# EAGLE design G11_CG_for_G8 (EAGLE 9.2.2)
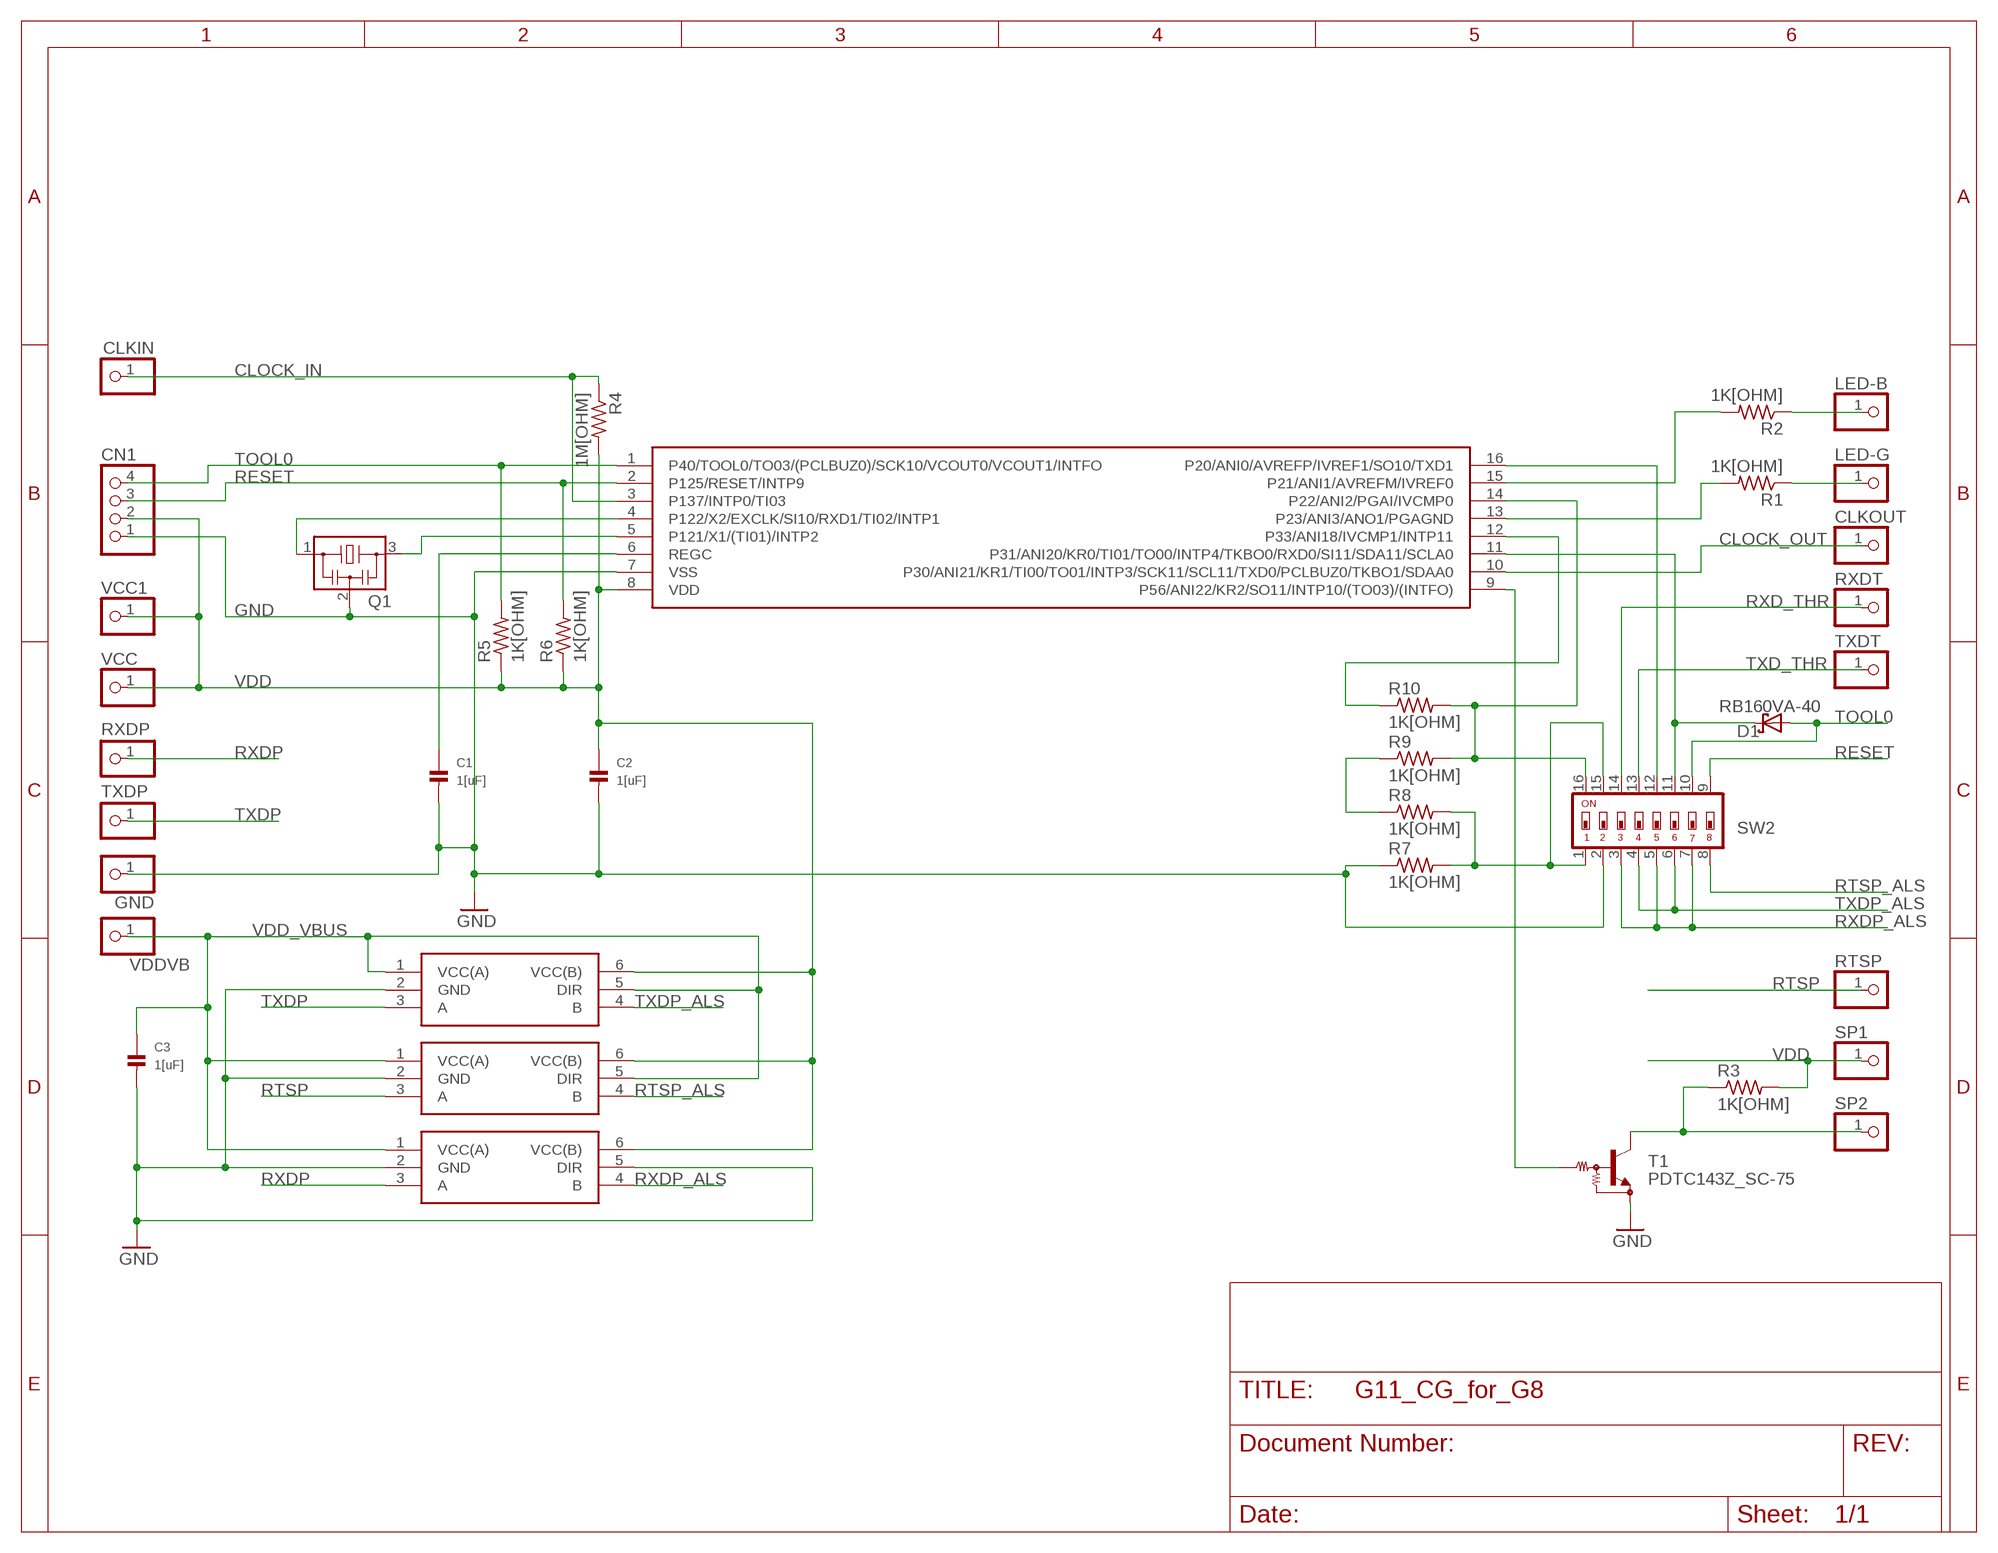
[diagram p0: schematic, sheet 1]

## Parts
C1  1[uF]  CAP_CERAMIC_0603  [_0603]
C2  1[uF]  CAP_CERAMIC_0603  [_0603]
C3  1[uF]  CAP_CERAMIC_0603  [_0603]
CLKIN  PINHD-1X1  [1X01]
CLKOUT  PINHD-1X1  [1X01]
CN1  PINHD-1X4  [1X04]
D1  RB160VA-40  [TUMD2]
GND  PINHD-1X1  [1X01]
LED-B  PINHD-1X1  [1X01]
LED-G  PINHD-1X1  [1X01]
Q1  CSTNE  [CSTNE]
R1  1K[OHM]  R-US_R0603  [R0603]
R2  1K[OHM]  R-US_R0603  [R0603]
R3  1K[OHM]  R-US_R0603  [R0603]
R4  1M[OHM]  R-US_R0603  [R0603]
R5  1K[OHM]  R-US_R0603  [R0603]
R6  1K[OHM]  R-US_R0603  [R0603]
R7  1K[OHM]  R-US_R0603  [R0603]
R8  1K[OHM]  R-US_R0603  [R0603]
R9  1K[OHM]  R-US_R0603  [R0603]
R10  1K[OHM]  R-US_R0603  [R0603]
RTSP  PINHD-1X1  [1X01]
RXDP  PINHD-1X1  [1X01]
RXDT  PINHD-1X1  [1X01]
SP1  PINHD-1X1  [1X01]
SP2  PINHD-1X1  [1X01]
SW2  SWS008  [SMS-008]
T1  PDTC143Z_SC-75  DTC1XXXZPDTC143Z  [SC-75]
TXDP  PINHD-1X1  [1X01]
TXDT  PINHD-1X1  [1X01]
U1  RL78/G11_SSOP16  [SSOP16_(4.4X5.0)]
U2  74LVC1T45W6  [SOT-26]
U3  74LVC1T45W6  [SOT-26]
U4  74LVC1T45W6  [SOT-26]
VCC  PINHD-1X1  [1X01]
VCC1  PINHD-1X1  [1X01]
VDDVB  PINHD-1X1  [1X01]

## Nets
CLOCK_IN: CLKIN.1 R4.1 U1.3(P137/INTP0/TI03)
CLOCK_OUT: CLKOUT.1 U1.10(P30/ANI21/KR1/TI00/TO01/INTP3/SCK11/SCL11/TXD0/PCLBUZ0/TKBO1/SDAA0)
GND: C1.2 C2.2 C3.2 CN1.1 GND.1 Q1.2 R7.1 SW2.2 T1.2(E) U1.7(VSS) U2.2(GND) U3.2(GND) U4.2(GND) U4.5(DIR)
N$2: R3.1 SP2.1 T1.3(C)
N$3: T1.1(B) U1.9(P56/ANI22/KR2/SO11/INTP10/(TO03)/(INTFO))
N$4: LED-B.1 R2.1
N$6: LED-G.1 R1.1
N$7: R1.2 U1.13(P23/ANI3/ANO1/PGAGND)
N$8: Q1.3 U1.5(P121/X1/(TI01)/INTP2)
N$9: R2.2 U1.15(P21/ANI1/AVREFM/IVREF0)
N$10: Q1.1 U1.4(P122/X2/EXCLK/SI10/RXD1/TI02/INTP1)
N$11: C1.1 U1.6(REGC)
N$13: R9.2 R10.2 SW2.16 U1.14(P22/ANI2/PGAI/IVCMP0)
N$14: SW2.12 U1.16(P20/ANI0/AVREFP/IVREF1/SO10/TXD1)
N$15: R8.1 R9.1
N$16: R7.2 R8.2 SW2.1 SW2.15
N$17: R10.1 U1.12(P33/ANI18/IVCMP1/INTP11)
N$19: D1.P$1(C) SW2.11 U1.11(P31/ANI20/KR0/TI01/TO00/INTP4/TKBO0/RXD0/SI11/SDA11/SCLA0)
RESET: CN1.3 R6.2 SW2.9 U1.2(P125/RESET/INTP9)
RTSP: RTSP.1 U3.3(A)
RTSP_ALS: SW2.8 U3.4(B)
RXD_THR: RXDT.1 SW2.14
RXDP: RXDP.1 U4.3(A)
RXDP_ALS: SW2.3 SW2.5 SW2.7 U4.4(B)
TOOL0: CN1.4 D1.P$2(A) R5.2 SW2.10 U1.1(P40/TOOL0/TO03/(PCLBUZ0)/SCK10/VCOUT0/VCOUT1/INTFO)
TXD_THR: SW2.13 TXDT.1
TXDP: TXDP.1 U2.3(A)
TXDP_ALS: SW2.4 SW2.6 U2.4(B)
VDD: C2.1 CN1.2 R3.2 R4.2 R5.1 R6.1 SP1.1 U1.8(VDD) U2.6(VCC(B)) U3.6(VCC(B)) U4.6(VCC(B)) VCC1.1 VCC.1
VDD_VBUS: C3.1 U2.1(VCC(A)) U2.5(DIR) U3.1(VCC(A)) U3.5(DIR) U4.1(VCC(A)) VDDVB.1

## Library data of the parts
C1-C3 = microbuilder:CAP_CERAMIC: Ceramic Capacitors 0402 - 0402 Surface Mount Capacitors 16pF 50V 5% [Digikey: 445-4899-2-ND] 18pF 50V 5% [Digikey: 490-1281-2-ND] 22pF 50V 5% [Digikey: 490-1283-2-ND] 68pF 50V 5% [Digikey: 490-1289-2-ND] 0.1uF 10V 10% [Digikey: 490-1318-2-ND] 1.0uF 6.3V 10% [Digikey: 490-1320-2-ND] 0603 - 0603 Surface Mount Capacitors 16 pF 50V 5% [Digikey: 445-5051-2-ND] 22 pF 50V [Digikey: PCC220ACVTR-ND] 33 pF 50V 5% [Digikey: 490-1415-1-ND] 56pF 50V 5% [Digikey: 490-1421-1-ND] 220pF 50V 5% [Digikey: 445-1285-1-ND] 680 pF 50V 2200 pF 50V 5% C0G [Digikey: 445-1297-1-ND] 5600 pF 100V 5% X7R [Digikey: 478-3711-1-ND] 0.1 µF 25V 10% [Digikey: PCC2277TR-ND] 0.22 µF 16V 10% X7R [Digikey: 445-1318-1-ND] 1.0 µF 25V 10% [Digikey: 445-5146-2-ND] 0603 - RF Specific 3pF 250V +/-0.1pF RF [Digikey: 712-1347-1-ND] 18 pF 250V 5% [Digikey: 478-3505-1-ND or 712-1322-1-ND] 56 pF 250V 5% C0G RF [Digikey: 490-4867-1-ND] 68 pF 250V RF [Digikey: 490-4868-1-ND] 0805 - 0805 Surface Mount Capacitors 220 pF 250V 2% RF Ceramic Capacitor [Digikey: 712-1398-1-ND] 1000 pF 50V 2% NP0 Ceramic Capacitor [Digikey: 478-3760-1-ND] 0.1 µF 25V 10% Ceramic Capacitor [Digikey: PCC1828TR-ND] 1.0 µF 16V 10% Ceramic Capacitor[Digikey: 490-1691-2-ND] 10.0 µF 10V 10% Ceramic Capacitor[Digikey: 709-1228-1-ND] 10.0 uF 16V 10% Ceramic Capacitor [Digikey: 478-5165-2-ND] 47 uF 6.3V 20% Ceramic Capacitor [Digikey: 587-1779-1-ND or 399-5506-1-ND] 1206 - 1206 Surface Mount Capacitors 47uF 10V 20% Ceramic Capacitor [Digikey: 490-5528-1-ND or 399-5508-1-ND or 445-6010-1-ND] 100uF 6.3V -20%, +80% Y5V Ceramic Capacitor (Digikey: 490-4512-1-ND, Mouser: 81-GRM31CF50J107ZE1L)
CLKIN CLKOUT GND LED-B LED-G RTSP RXDP RXDT SP1 SP2 TXDP TXDT VCC VCC1 VDDVB = pinhead:PINHD-1X1: PIN HEADER
CN1 = pinhead:PINHD-1X4: PIN HEADER
D1 = okadaLib:RB160VA-40: ROHM shottkey diode
Q1 = yoshino_low_tech:CSTNE: Murata Ceramic Resonator CSTNE Series
R1-R10 = resistor:R-US_: RESISTOR, American symbol
SW2 = smd-special:SWS008: SMD Dip Switch 8 pol.
T1 = okadaLib:DTC1XXXZ: Digital Transistor
U1 = yoshino_low_tech:RL78/G11_SSOP16: 16bit MCU RL78/G11 16pin SSOP
U2-U4 = yoshino_low_tech:74LVC1T45W6: Bidirectional 1circuit Level shifter https://www.diodes.com/assets/Datasheets/74LVC1T45.pdf

## Net classes
2 GND: width 0.254 mm

## Board
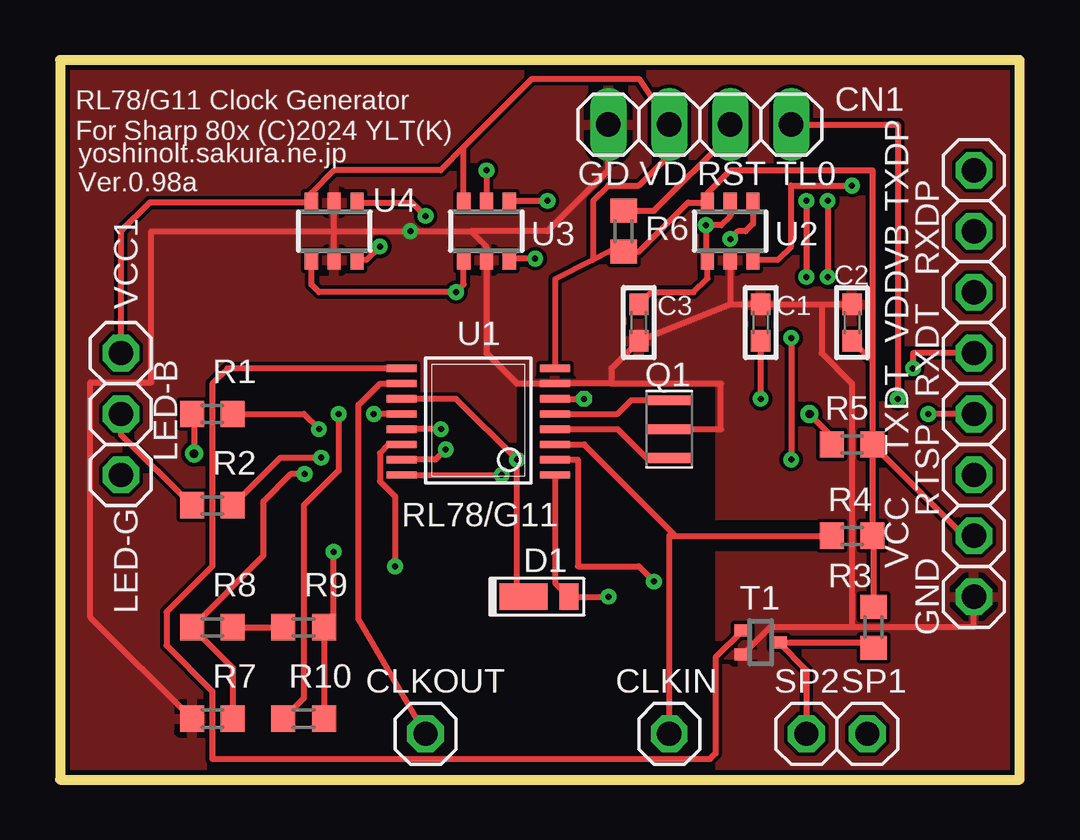
[diagram p1: board, top side]
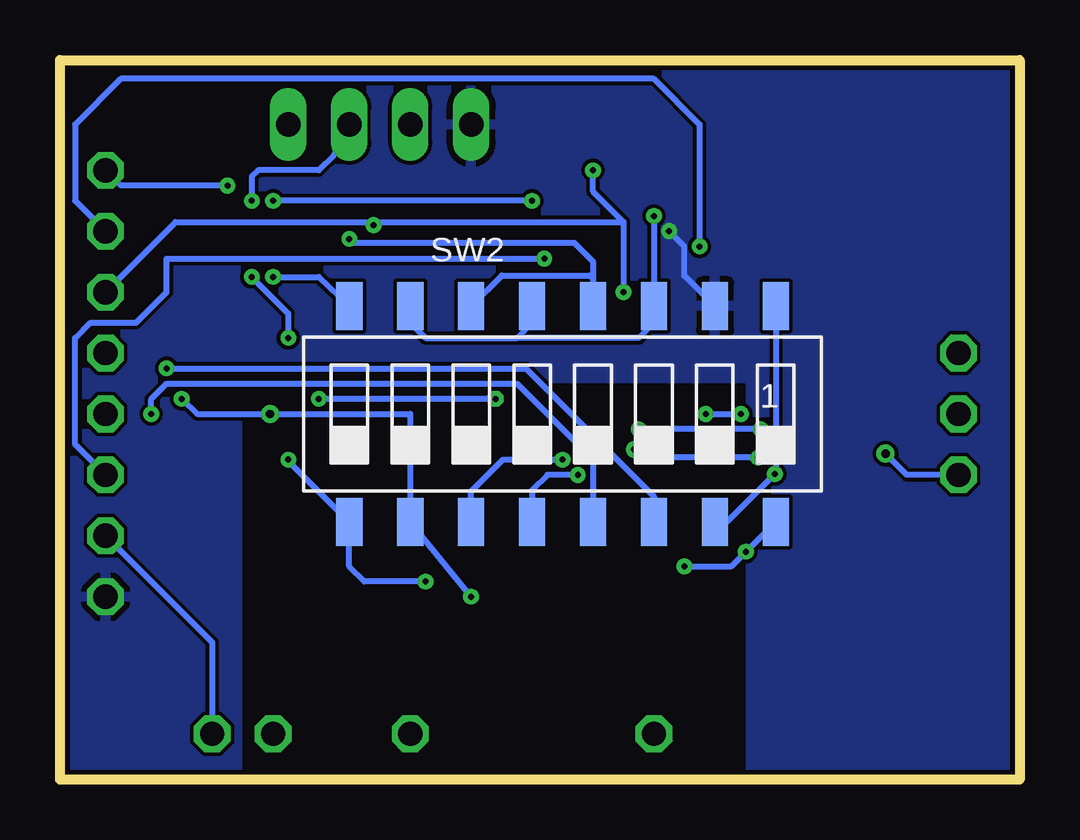
[diagram p2: board, bottom side, seen from below]

Size 40 x 30 mm. Coordinates in mm from the lower left corner, seen from the top.
Outline: 0,0 40,0 40,30 0,30 0,0
Copper layers (1*16): Top 0.035mm / dielectric 1.5mm / Bottom 0.035mm
Design rules "PCBGoGo": minimum track width 6mil, minimum drill 0.2mm, track to track 6mil, track to pad 6mil, pad to pad 6mil, via to via 6mil, smd to smd 6mil, copper to edge 0.2mm, drill to drill 6mil, minimum pad ring 10mil, minimum via ring 8mil, stop-mask expansion 4mil, vias tented up to drill 0mil, thermal gap 10mil
tRestrict: area 19.1,0 to 27.3,16.5; area 27.3,9.5 to 31.5,10.8
bRestrict: area 11.4,0 to 32.4,16.5

### Footprints (pad centres in the part's own frame; a part is rotated, then mirrored left to right if it is on the bottom)
_0603 = smd 0.9 x 0.8: 1 -0.762,0; 2 0.762,0
1X01 = drill 1.016 octagon: 1 0,0
1X04 = drill 1.016 long: 1 -3.81,0; 2 -1.27,0; 3 1.27,0; 4 3.81,0
TUMD2 = smd 1.1 x 2: P$1 0,1 | smd 1.1 x 0.8: P$2 0,-0.9
CSTNE = smd 0.4 x 1.9: 1 -1.2,0; 2 0,0; 3 1.2,0
R0603 = smd 1 x 1.1: 1 -0.85,0; 2 0.85,0
SMS-008 = smd 1.092 x 2.007: 1 -8.89,-4.496; 2 -6.35,-4.496; 3 -3.81,-4.496; 4 -1.27,-4.496; 5 1.27,-4.496; 6 3.81,-4.496; 7 6.35,-4.496; 8 8.89,-4.496; 9 8.89,4.496; 10 6.35,4.496; 11 3.81,4.496; 12 1.27,4.496; 13 -1.27,4.496; 14 -3.81,4.496; 15 -6.35,4.496; 16 -8.89,4.496
SC-75 = smd 0.5 x 0.7: 1 -0.5,-0.75; 2 0.5,-0.75; 3 0,0.75
SSOP16_(4.4X5.0) = smd 0.305 x 1.245: 1 0,-5.4; 2 0.635,-5.4; 3 1.27,-5.4; 4 1.905,-5.4; 5 2.54,-5.4; 6 3.175,-5.4; 7 3.81,-5.4; 8 4.445,-5.4; 9 4.445,1; 10 3.81,1; 11 3.175,1; 12 2.54,1; 13 1.905,1; 14 1.27,1; 15 0.635,1; 16 0,1
SOT-26 = smd 0.55 x 0.8: 1 -0.95,-1.2; 2 0,-1.2; 3 0.95,-1.2; 4 0.95,1.2; 5 0,1.2; 6 -0.95,1.2

### Placement (x,y rotation side)
C1  29.21,19.05 90 top
C2  33.02,19.05 90 top
C3  24.13,19.05 270 top
CLKIN  25.4,1.91 90 top
CLKOUT  15.24,1.91 90 top
CN1  26.67,27.3 0 top
D1  20.32,7.62 90 top
GND  38.1,7.62 0 top
LED-B  2.54,15.24 90 top
LED-G  2.54,12.7 90 top
Q1  25.4,14.61 90 top
R1  6.35,15.24 0 top
R2  6.35,11.43 0 top
R3  33.91,6.35 90 top
R4  33.02,10.16 0 top
R5  33.02,13.97 180 top
R6  23.5,22.86 90 top
R7  6.35,2.54 0 top
R8  6.35,6.35 180 top
R9  10.16,6.35 0 top
R10  10.16,2.54 0 top
RTSP  38.1,12.7 90 top
RXDP  38.1,22.86 90 top
RXDT  38.1,17.78 90 top
SP1  33.66,1.91 0 top
SP2  31.11,1.91 0 top
SW2  19.05,15.24 180 bottom
T1  29.21,5.71 270 top
TXDP  38.1,25.4 90 top
TXDT  38.1,15.24 90 top
U1  15.24,12.7 90 top
U2  27.94,22.86 0 top
U3  17.78,22.86 0 top
U4  11.43,22.86 0 top
VCC  38.1,10.16 0 top
VCC1  2.54,17.78 270 top
VDDVB  38.1,20.32 90 top

### Tracks (layer width: path | path; a pad name or v marks a point on that pad's centre or on a via)
CLOCK_IN
  Top 0.254: CLKIN.1 25.4,10.16 25.65,10.16 | 25.65,10.16 R4.1 | U1.3 21.84,13.97 25.65,10.16
CLOCK_OUT
  Top 0.254: CLKOUT.1 12.45,6.7 12.45,15.62 13.34,16.51 U1.10
GND  (via drill 0.25)
  Top 0.254: 27.94,19.81 C1.2 C2.2 31.75,19.81 31.75,17.78 33.02,16.51 33.02,14.61 33.02,6.35 | 27.94,19.81 C3.2 22.99,17.14 22.99,16.51 | U2.2 27.94,19.81 | 22.99,16.51 U1.7 19.05,16.51 17.78,17.78 U3.2 17.78,22.23 17.14,22.86 | U4.2 11.43,22.86 | 11.43,22.86 U4.5 | 11.43,22.86 v14.61,22.86 17.14,22.86 | 33.02,6.35 29.59,6.35 T1.2 | GND.1 38.1,6.35 33.02,6.35 | 17.14,22.86 20.32,22.86 22.86,25.4 CN1.1 | R7.1 1.27,6.77 1.27,16.56 3.81,16.56 3.81,22.86 11.43,22.86 | 22.99,16.51 27.56,16.51 27.56,14.61 Q1.2
  Bottom 0.254: SW2.2 13.97,21.01 13.97,22.23 v14.61,22.86
  pour Top: 40,30 0,30 0,0 40,0
  pour Bottom: 40,30 0,30 0,0 40,0
N$2
  Top 0.254: R3.1 33.69,5.71 T1.3 31.11,4.56 SP2.1
N$3
  Top 0.254: U1.9 6.99,17.14 6.35,16.51 6.35,8.89 4.45,6.99 4.45,5.59 6.35,3.68 6.35,0.86 27.1,0.86 27.33,1.09 27.33,5.08 T1.1
N$4
  Top 0.254: R2.1 2.54,14.39 LED-B.1
N$6  (via drill 0.35)
  Top 0.254: R1.1 5.59,15.15 v5.59,13.59
  Bottom 0.254: v5.59,13.59 4.7,12.7 LED-G.1
N$7  (via drill 0.25)
  Top 0.254: R1.2 10.16,15.24 v10.79,14.61 | v15.88,14.61 U1.13
  Bottom 0.254: v10.79,14.61 v15.88,14.61
N$8
  Top 0.254: U1.5 23.24,15.24 23.81,15.8 Q1.3
N$9  (via drill 0.25)
  Top 0.254: R2.2 9.19,13.42 v10.88,13.42 | v16.08,13.76 15.65,13.34 U1.15
  Bottom 0.254: v10.88,13.42 15.74,13.42 v16.08,13.76
N$10
  Top 0.254: U1.4 23.25,14.61 24.45,13.4 Q1.1
N$11  (via drill 0.25)
  Top 0.254: U1.6 v21.84,15.88 | v29.21,15.88 C1.1
  Bottom 0.254: v21.84,15.88 v29.21,15.88
N$13  (via drill 0.25)
  Top 0.254: R10.2 R9.2 11.4,6.75 v11.4,9.5 | U1.14 | U1.14 13.71,13.97 13.34,13.6 13.34,12.43 13.97,11.8 v13.97,8.89
  Bottom 0.254: v13.97,8.89 12.01,8.89 v11.4,9.5 SW2.16
N$14  (via drill 0.25)
  Top 0.254: U1.16 v18.41,12.7
  Bottom 0.254: v18.41,12.7 19.68,12.7 20.32,12.06 SW2.12
N$15
  Top 0.254: R8.1 R9.1
N$16  (via drill 0.25)
  Top 0.254: R7.2 7.2,4.65 R8.2 8.48,9.33 8.48,11.6 9.62,12.74 v10.2,12.74
  Bottom 0.254: SW2.1 10.16,12.78 v10.2,12.74 12.19,10.74 SW2.15
N$17  (via drill 0.25)
  Top 0.254: U1.12 v13.08,15.24 | v11.62,15.24 11.62,12.88 10.16,11.43 10.16,3.39 R10.1
  Bottom 0.254: v13.08,15.24 v11.62,15.24
N$19  (via drill 0.25)
  Top 0.254: U1.11 16.51,15.88 v19.05,13.34 19.05,7.88 D1.P$1
  Bottom 0.254: SW2.11 22.86,12.01 21.54,13.34 v19.05,13.34
RESET  (via drill 0.25)
  Top 0.254: R6.2 24.77,23.71 27.94,26.89 CN1.3 | v32,24.13 v32,20.95 | v30.48,18.41 v30.48,13.34 | U1.2 21.59,13.34 21.59,8.89 24.13,8.89 v24.77,8.26
  Bottom 0.254: v32,24.13 32,25.15 31.75,25.4 29.21,25.4 28.57,26.04 CN1.3 | v32,20.95 30.48,19.43 v30.48,18.41 | v24.77,8.26 27.3,8.26 27.94,8.89 SW2.9 30.48,13.28 v30.48,13.34
RTSP  (via drill 0.25)
  Top 0.254: v19.81,21.72 18.79,21.72 U3.3
  Bottom 0.254: RTSP.1 39.37,13.97 39.37,18.41 38.73,19.05 36.83,19.05 35.56,20.32 35.56,21.72 v19.81,21.72
RTSP_ALS  (via drill 0.25)
  Top 0.254: U3.4 19.05,24.13 v20.32,24.13 | v31.11,24.13 v31.11,20.95
  Bottom 0.254: v20.32,24.13 v31.11,24.13 | v31.11,20.95 29.21,20.95 SW2.8
RXD_THR  (via drill 0.25)
  Top 0.254: RXDT.1 35.56,17.78 v35.56,17.14
  Bottom 0.254: v35.56,17.14 20.57,17.14 15.24,11.81 SW2.14
RXDP  (via drill 0.25)
  Top 0.254: v13.34,22.23 12.77,21.66 U4.3
  Bottom 0.254: v13.34,22.23 13.34,27.3 15.24,29.21 37.47,29.21 39.37,27.3 39.37,24.13 RXDP.1
RXDP_ALS  (via drill 0.25)
  Top 0.254: U4.4 14.68,24.06 v15.24,23.5
  Bottom 0.254: SW2.7 25.4,19.05 24.77,18.41 20.95,18.41 | 20.95,18.41 20.32,19.05 SW2.5 | 20.95,18.41 15.88,18.41 15.24,19.05 SW2.3 v15.24,23.5
TOOL0  (via drill 0.25, 0.35)
  Top 0.254: v34.92,15.88 34.92,27.3 CN1.4 | R5.2 32.17,14.31 v31.24,15.24 | v22.86,7.62 D1.P$2 20.64,8.2 U1.1
  Bottom 0.254: v34.92,15.88 34.29,15.24 v31.24,15.24 25.4,15.24 SW2.10 v22.86,7.62
TXD_THR  (via drill 0.25)
  Top 0.254: TXDT.1 v36.2,15.24
  Bottom 0.254: v36.2,15.24 36.2,15.88 35.56,16.51 20.95,16.51 17.78,13.34 SW2.13
TXDP  (via drill 0.25)
  Top 0.254: U2.3 29.91,21.66 30.48,22.23 30.48,24.77 v33.02,24.77
  Bottom 0.254: v33.02,24.77 37.47,24.77 TXDP.1
TXDP_ALS  (via drill 0.25)
  Top 0.254: U2.4 28.89,23.18 28.57,22.86 28.26,22.86 v27.94,22.54
  Bottom 0.254: v27.94,22.54 27.78,22.38 18.57,22.38 17.78,21.59 17.78,20.89 | SW2.6 21.58,21.02 17.91,21.02 17.78,20.89 | 17.78,20.89 SW2.4
VDD
  Top 0.254: U3.6 16.83,26.36 | 16.83,26.36 15.88,25.4 11.43,25.4 10.48,24.45 U4.6 3.74,24.06 2.54,22.86 VCC1.1 | C2.1 33.87,17.44 | 33.87,17.44 R5.1 | R5.1 R4.2 33.91,10.12 R3.2 | R5.1 37.68,10.16 VCC.1 | 33.87,17.44 33.87,25.4 27.94,25.4 26.99,24.45 U2.6 26.18,24.06 24.13,22.01 R6.1 22.89,22.01 22.19,21.65 | 22.19,21.65 20.64,20.86 U1.8 | 22.19,21.65 22.23,21.68 22.23,24.13 22.86,24.77 24.13,24.77 25.4,26.04 CN1.2 24.13,29.21 19.68,29.21 16.83,26.36
  Bottom 0.254: VCC.1 33.66,5.71 SP1.1
VDD_VBUS  (via drill 0.25)
  Top 0.254: U2.5 27.94,23.5 27.56,23.11 v26.92,23.11 26.92,21.79 U2.1 26.99,20.89 26.42,20.32 24.64,20.32 C3.1 | v17.78,25.4 U3.5 | U3.1 16.83,20.64 v16.51,20.32 10.79,20.32 10.48,20.64 U4.1
  Bottom 0.254: VDDVB.1 35.18,23.24 27.05,23.24 v26.92,23.11 26.92,23.24 16.51,23.24 | 16.51,23.24 v16.51,20.32 | 16.51,23.24 17.78,24.51 v17.78,25.4

### Text on the board
tNames: RL78/G11 Clock Generator | For Sharp 80x (C)2024 YLT(K) | yoshinolt.sakura.ne.jp / Ver.0.98a | GD VD RST TL0 | RL78/G11 | D1